# Altium schematic sheet SupplyPower.SchDoc: Power Supply
size A4; Author: Anderson, Jorge; CompanyName: LEICI - FI-UNLP; Revision: 1.0; SheetNumber: 6; SheetTotal: 6; ProjectName: Placa adaptadora TMS320F28335
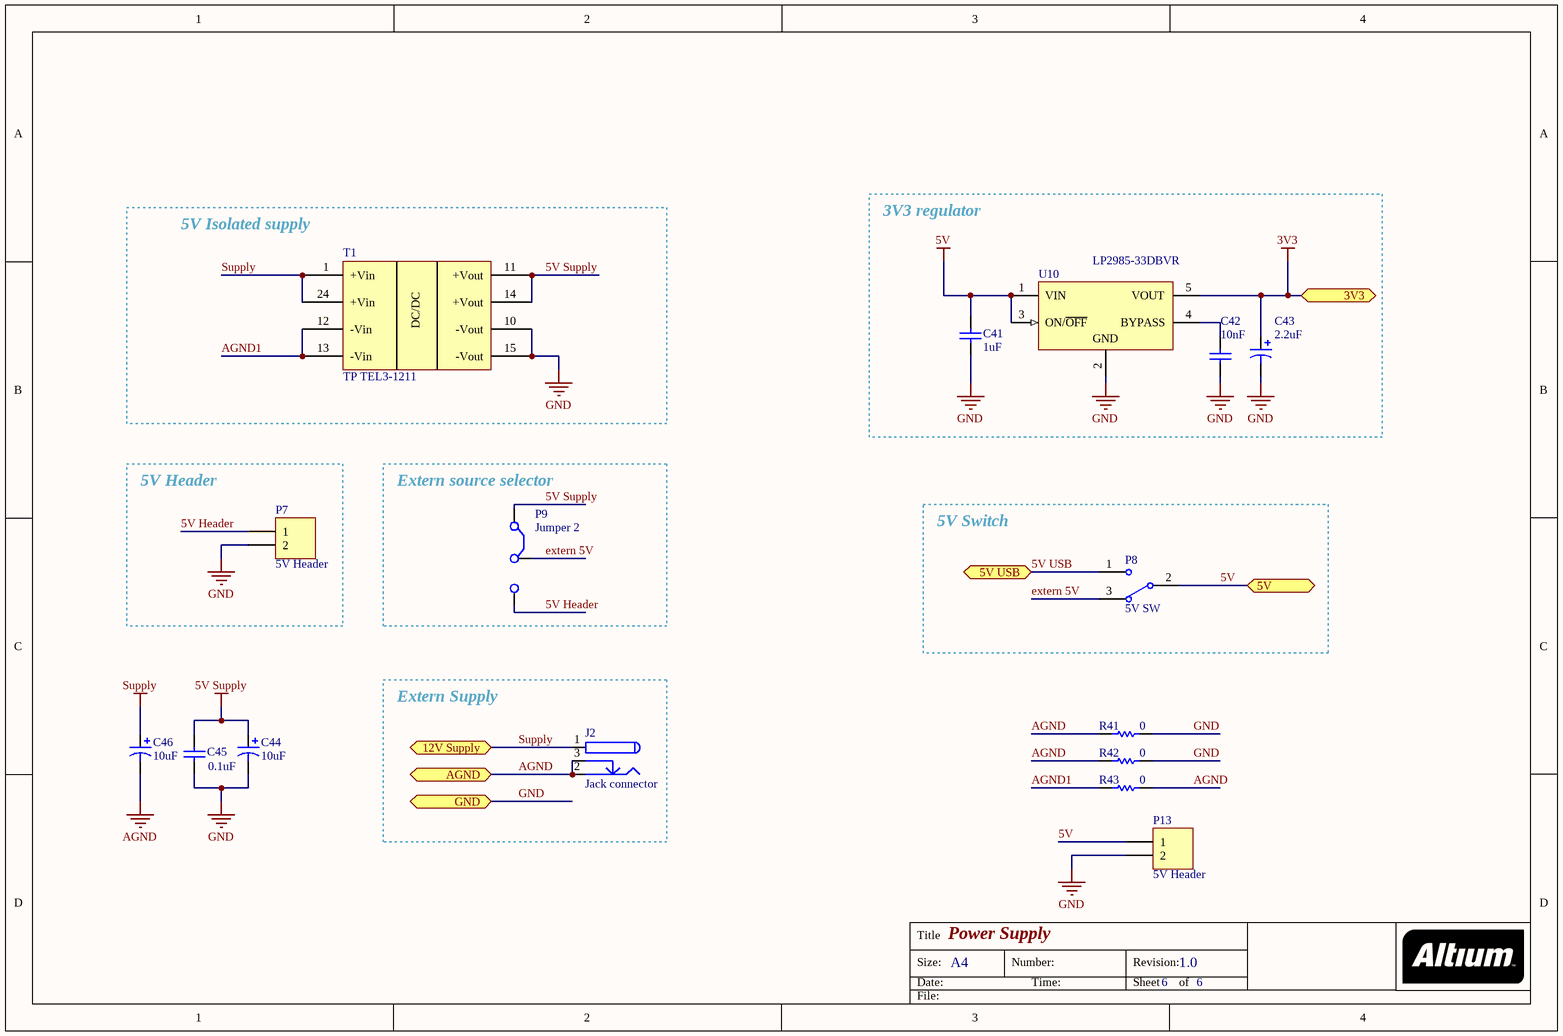
[diagram p0: SupplyPower.SchDoc]

## Parts
C41  value 1uF  [0805]  (hidden comment: C1u)
C42  value 10nF  [C 1206]  (hidden comment: C10n)
C43  value 2.2uF  [Tantalum]  (hidden comment: CT2.2u)
C44  value 10uF  [Almn cap]  (hidden comment: C10u)
C45  value 0.1uF  [C 1206]  (hidden comment: C0.1u)
C46  value 10uF  [CAP4x7x1.5mm]  (hidden comment: C10u)
J2  Jack connector
P7  5V Header  [HDR1X2]
P8  5V SW  [Toggle sw]
P9  Jumper 2  [Jumper 2]
P13  5V Header  [HDR1X2]
R41  value 0  [R 1206]  (hidden comment: R0)
R42  value 0  [R 1206]  (hidden comment: R0)
R43  value 0  [R 1206]  (hidden comment: R0)
T1  TP TEL3-1211
U10  LP2985-33DBVR  [TI-DBV5_N]

## Blocks framed on the sheet
3V3 regulator: C41-C43 U10
5V Isolated supply: T1
5V Header: P7
Extern source selector: P9
5V Switch: P8
Extern Supply: J2

## Ports
3V3, 5V, 5V USB, 12V Supply, AGND, GND

## Nets
3V3: C43.1 U10.5(VOUT) ; port 3V3
5V: C41.1 P8.2 P13.1 U10.1(VIN) U10.3(ON/~{OFF}) ; port 5V
5V Supply: C44.1 C45.2 P9.1(C1) T1.11(+Vout) T1.14(+Vout)
AGND: C46.2 J2.2 J2.3 R41.2 R42.2 R43.1 ; port AGND
GND: C41.2 C42.2 C43.2 C44.2 C45.1 P7.2 P13.2 R41.1 R42.1 T1.10(-Vout) T1.15(-Vout) U10.2(GND) ; port GND
Supply: C46.1 J2.1 T1.1(+Vin) T1.24(+Vin) ; port 12V Supply
5V Header: P7.1 P9.3(C3)
5V USB: P8.1 ; port 5V USB
AGND1: R43.2 T1.12(-Vin) T1.13(-Vin)
extern 5V: P8.3 P9.2(C2)
NetC42_1: C42.1 U10.4(BYPASS)

## Notes on the sheet
- Title
- Size:
- Date:
- A4
- Number:
- Time:
- Revision:
- Sheet
- of
- File:
- (in symbol TP TEL3-1211) DC/DC

## Library data of the parts
C41 C42 C45 = C: Capacitor; .PCBCheck: Used; .Creator: SR; .SCHCheck: Used; Category: Capacitores
C43 = C Tantalum: Tantalum capacitor
C44 C46 = Capacitor pol: Capacitor polarzado
P7 P13 = Header 2: Header, 2-Pin; LatestRevisionDate: 17-Jul-2002; LatestRevisionNote: Re-released for DXP Platform.; Publisher: Altium Limited
P8 = toggle sw
R41-R43 = R: Resistencia; .Creator: SR; .PCBCheck: Used; .SCHCheck: Used; Category: Resistencias
U10 = LP2985-10DBVR: Single Output Low Noise LDO, 150 mA, Fixed 3.3 V Output, 2.2 to 16 V Input, with Low IQ, 5-pin SOT-23 (DBV), -40 to 125 degC, Green (RoHS & no Sb/Br); Manufacturer: Texas Instruments; Accuracy(%): 1.5; Fixed Output Options(V): 3.3; Iout(Max)(A): 0.15; Iq(Typ)(mA): 0.85; SubFamily: Single Channel LDO; Vdo(Typ)(mV): 280; Vin(Max)(V): 16; Vin(Min)(V): 2.2; DatasheetVersion: SLVS522N; PackageVersion: 4073253-4/K; PackageReference: DBV5; PackageDescription: 5-Pin Plastic Small Outline, Body 1.60 Ã— 2.90 mm, Pitch 0.95 mm; Eco-Plan: Green (RoHS & no Sb/Br); Vout Adj(Max)(V): 3.3; Vout Adj(Min)(V): 3.3; Mounting Technology: Surface Mount; Code_JEDEC: MO-178; PartNumber: LP2985-33DBVR; ComponentLink1Description: Manufacturer URL; ComponentLink1URL: http://www.ti.com/; ComponentLink2Description: Datasheet; ComponentLink2URL: http://www.ti.com/general/docs/lit/getliterature.tsp?genericPartNumber=LP2985-10&fileType=pdf; ComponentLink3Description: Package Specification; ComponentLink3URL: http://www.ti.com/litv/pdf/mpds018i; Supplier 1: Farnell; Supplier Part Number 1: 2412118; Supplier 2: Digi-Key; Supplier Part Number 2: 296-18476-6-ND